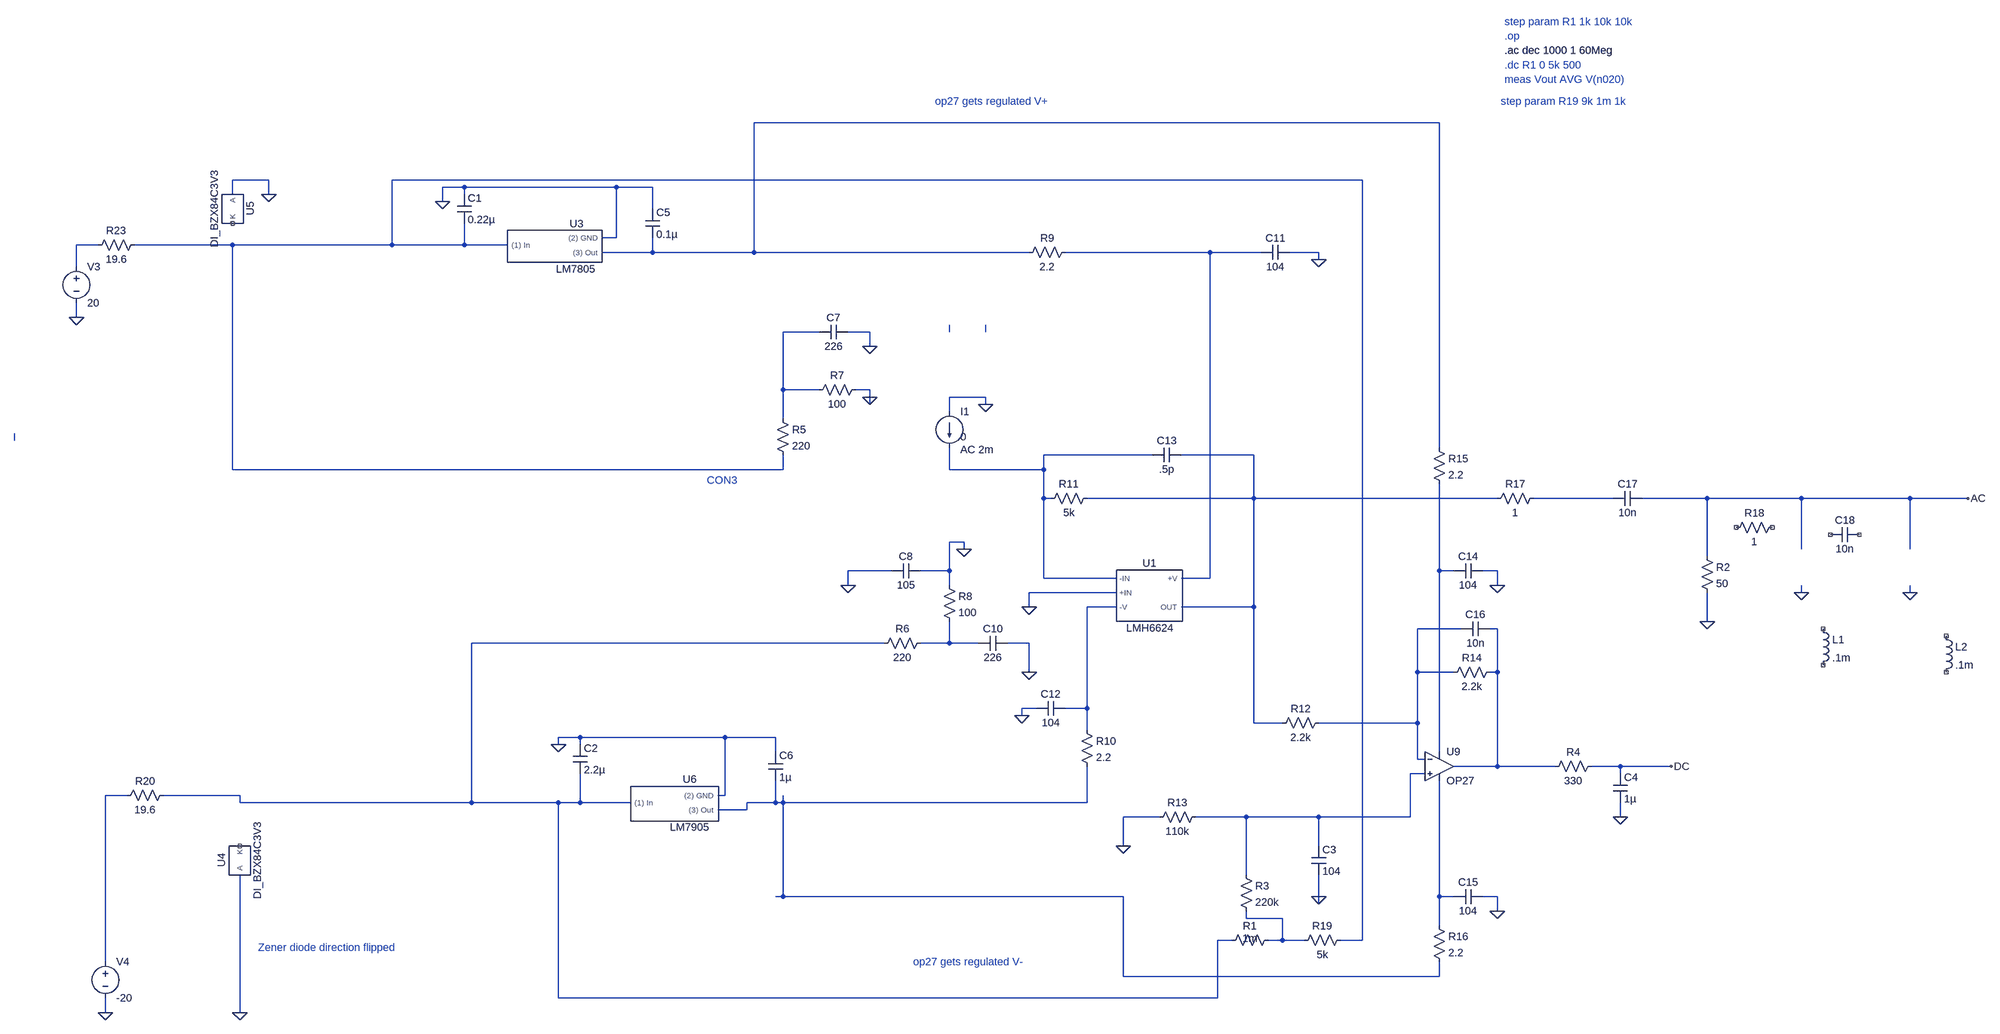
[diagram p0: schematic Photodetector_v2_3.asc]
Photodetector_v2_3.asc, the LTspice schematic file:
Version 4.1
SHEET 1 3536 1256
WIRE 2032 -1264 496 -1264
WIRE -576 -1088 -656 -1088
WIRE 1840 -1088 -304 -1088
WIRE -144 -1072 -192 -1072
WIRE 192 -1072 -144 -1072
WIRE 272 -1072 192 -1072
WIRE -656 -1056 -656 -1088
WIRE -576 -1056 -576 -1088
WIRE -144 -1056 -144 -1072
WIRE -192 -1040 -192 -1072
WIRE 272 -1024 272 -1072
WIRE 192 -960 192 -1072
WIRE 192 -960 160 -960
WIRE -1088 -944 -1136 -944
WIRE -656 -944 -1008 -944
WIRE -304 -944 -304 -1088
WIRE -304 -944 -656 -944
WIRE -144 -944 -144 -992
WIRE -144 -944 -304 -944
WIRE -48 -944 -144 -944
WIRE 272 -928 272 -960
WIRE 272 -928 160 -928
WIRE 496 -928 496 -1264
WIRE 496 -928 272 -928
WIRE 1104 -928 496 -928
WIRE 1504 -928 1184 -928
WIRE 1616 -928 1504 -928
WIRE 1744 -928 1680 -928
WIRE 1744 -912 1744 -928
WIRE -1136 -896 -1136 -944
WIRE -1136 -784 -1136 -816
WIRE 640 -752 560 -752
WIRE 752 -752 704 -752
WIRE 928 -752 928 -768
WIRE 1008 -752 1008 -768
WIRE 752 -720 752 -752
WIRE 560 -624 560 -752
WIRE 640 -624 560 -624
WIRE 752 -624 720 -624
WIRE 752 -608 752 -624
WIRE 1008 -608 928 -608
WIRE 752 -592 752 -608
WIRE 1008 -592 1008 -608
WIRE 928 -576 928 -608
WIRE 560 -560 560 -624
WIRE -1328 -512 -1328 -528
WIRE 2032 -496 2032 -1264
WIRE 1376 -480 1136 -480
WIRE 1600 -480 1440 -480
WIRE -656 -448 -656 -944
WIRE 560 -448 560 -480
WIRE 560 -448 -656 -448
WIRE 928 -448 928 -496
WIRE 1136 -448 1136 -480
WIRE 1136 -448 928 -448
WIRE 1136 -384 1136 -448
WIRE 1152 -384 1136 -384
WIRE 1600 -384 1600 -480
WIRE 1600 -384 1232 -384
WIRE 2160 -384 1600 -384
WIRE 2416 -384 2240 -384
WIRE 2624 -384 2480 -384
WIRE 2832 -384 2624 -384
WIRE 3072 -384 2832 -384
WIRE 3200 -384 3072 -384
WIRE 960 -288 928 -288
WIRE 960 -272 960 -288
WIRE 2832 -272 2832 -384
WIRE 3072 -272 3072 -384
WIRE 2624 -256 2624 -384
WIRE 800 -224 704 -224
WIRE 928 -224 928 -288
WIRE 928 -224 864 -224
WIRE 2032 -224 2032 -416
WIRE 2064 -224 2032 -224
WIRE 2160 -224 2128 -224
WIRE 1136 -208 1136 -384
WIRE 1296 -208 1136 -208
WIRE 1504 -208 1504 -928
WIRE 1504 -208 1440 -208
WIRE 704 -192 704 -224
WIRE 928 -192 928 -224
WIRE 2160 -192 2160 -224
WIRE 1296 -176 1104 -176
WIRE 2832 -176 2832 -192
WIRE 3072 -176 3072 -192
WIRE 1104 -144 1104 -176
WIRE 1296 -144 1232 -144
WIRE 1600 -144 1600 -384
WIRE 1600 -144 1440 -144
WIRE 2624 -112 2624 -176
WIRE 2080 -96 1984 -96
WIRE 2160 -96 2144 -96
WIRE 784 -64 -128 -64
WIRE 928 -64 928 -112
WIRE 928 -64 864 -64
WIRE 992 -64 928 -64
WIRE 1104 -64 1056 -64
WIRE 1104 0 1104 -64
WIRE 1984 0 1984 -96
WIRE 2064 0 1984 0
WIRE 2160 0 2160 -96
WIRE 2160 0 2144 0
WIRE 1120 80 1088 80
WIRE 1232 80 1232 -144
WIRE 1232 80 1184 80
WIRE 1088 96 1088 80
WIRE 1600 112 1600 -144
WIRE 1664 112 1600 112
WIRE 1984 112 1984 0
WIRE 1984 112 1744 112
WIRE 1232 128 1232 80
WIRE 112 144 64 144
WIRE 432 144 112 144
WIRE 544 144 432 144
WIRE 64 160 64 144
WIRE 112 160 112 144
WIRE 544 176 544 144
WIRE 2032 176 2032 -224
WIRE 1984 192 1984 112
WIRE 2000 192 1984 192
WIRE 2160 208 2160 0
WIRE 2160 208 2064 208
WIRE 2288 208 2160 208
WIRE 2432 208 2368 208
WIRE 2544 208 2432 208
WIRE 2000 224 1968 224
WIRE 2432 224 2432 208
WIRE -1024 272 -1072 272
WIRE -640 272 -944 272
WIRE 432 272 432 144
WIRE 432 272 416 272
WIRE -640 288 -640 272
WIRE -128 288 -128 -64
WIRE -128 288 -640 288
WIRE 64 288 -128 288
WIRE 112 288 112 224
WIRE 112 288 64 288
WIRE 224 288 112 288
WIRE 544 288 544 240
WIRE 544 288 480 288
WIRE 560 288 560 272
WIRE 560 288 544 288
WIRE 1232 288 1232 208
WIRE 1232 288 560 288
WIRE 480 304 480 288
WIRE 480 304 416 304
WIRE 1392 320 1312 320
WIRE 1584 320 1472 320
WIRE 1744 320 1584 320
WIRE 1968 320 1968 224
WIRE 1968 320 1744 320
WIRE 2432 320 2432 288
WIRE 1312 384 1312 320
WIRE 1744 384 1744 320
WIRE 1584 448 1584 320
WIRE 560 496 560 288
WIRE 560 496 544 496
WIRE 1312 496 560 496
WIRE 1744 496 1744 448
WIRE 2032 496 2032 240
WIRE 2064 496 2032 496
WIRE 2160 496 2128 496
WIRE 1744 512 1744 496
WIRE 2160 528 2160 496
WIRE 1584 544 1584 528
WIRE 1664 544 1584 544
WIRE 2032 560 2032 496
WIRE 1552 592 1520 592
WIRE 1664 592 1664 544
WIRE 1664 592 1632 592
WIRE 1712 592 1664 592
WIRE 1840 592 1840 -1088
WIRE 1840 592 1792 592
WIRE -1072 640 -1072 272
WIRE 1312 672 1312 496
WIRE 2032 672 2032 640
WIRE 2032 672 1312 672
WIRE 64 720 64 288
WIRE 1520 720 1520 592
WIRE 1520 720 64 720
WIRE -1072 752 -1072 720
WIRE -640 752 -640 448
FLAG 1104 0 0
FLAG 704 -192 0
FLAG 1104 -144 0
FLAG 2160 528 0
FLAG 2160 -192 0
FLAG 2624 -112 0
FLAG 752 -720 0
FLAG 1744 496 0
FLAG 1312 384 0
FLAG 64 160 0
FLAG 1088 96 0
FLAG 1744 -912 0
FLAG 3200 -384 AC
FLAG 2544 208 DC
FLAG -640 752 0
FLAG -576 -1056 0
FLAG -1136 -784 0
FLAG -1072 752 0
FLAG 2432 320 0
FLAG -192 -1040 0
FLAG 3072 -176 0
FLAG 2832 -176 0
FLAG 1008 -592 0
FLAG 752 -608 0
FLAG 960 -272 0
DATAFLAG 1136 -176 ""
DATAFLAG 1120 80 ""
DATAFLAG 2336 -384 ""
DATAFLAG 2112 -384 ""
DATAFLAG 208 -928 ""
DATAFLAG -592 -944 ""
DATAFLAG -480 288 ""
DATAFLAG 576 288 ""
DATAFLAG 1520 -144 ""
DATAFLAG 1504 -336 ""
DATAFLAG 1232 -96 ""
DATAFLAG 2160 208 ""
DATAFLAG 2160 -64 ""
DATAFLAG 1920 112 ""
DATAFLAG 2160 208 ""
DATAFLAG 2160 208 ""
DATAFLAG 2032 304 ""
DATAFLAG 2032 -160 ""
DATAFLAG 3200 -400 ""
DATAFLAG 3152 -384 ""
DATAFLAG 2528 208 ""
SYMBOL res 544 -576 R0
SYMATTR InstName R5
SYMATTR Value 220
SYMBOL res 880 -80 R90
WINDOW 0 0 56 VBottom 2
WINDOW 3 32 56 VTop 2
SYMATTR InstName R6
SYMATTR Value 220
SYMBOL res 736 -640 R90
WINDOW 0 0 56 VBottom 2
WINDOW 3 32 56 VTop 2
SYMATTR InstName R7
SYMATTR Value 100
SYMBOL res 912 -208 R0
SYMATTR InstName R8
SYMATTR Value 100
SYMBOL res 1200 -944 R90
WINDOW 0 0 56 VBottom 2
WINDOW 3 32 56 VTop 2
SYMATTR InstName R9
SYMATTR Value 2.2
SYMBOL res 1216 112 R0
SYMATTR InstName R10
SYMATTR Value 2.2
SYMBOL res 1248 -400 R90
WINDOW 0 0 56 VBottom 2
WINDOW 3 32 56 VTop 2
SYMATTR InstName R11
SYMATTR Value 5k
SYMBOL res 1760 96 R90
WINDOW 0 0 56 VBottom 2
WINDOW 3 32 56 VTop 2
SYMATTR InstName R12
SYMATTR Value 2.2k
SYMBOL res 1488 304 R90
WINDOW 0 0 56 VBottom 2
WINDOW 3 32 56 VTop 2
SYMATTR InstName R13
SYMATTR Value 110k
SYMBOL res 2160 -16 R90
WINDOW 0 0 56 VBottom 2
WINDOW 3 32 56 VTop 2
SYMATTR InstName R14
SYMATTR Value 2.2k
SYMBOL res 2016 -512 R0
SYMATTR InstName R15
SYMATTR Value 2.2
SYMBOL res 2016 544 R0
SYMATTR InstName R16
SYMATTR Value 2.2
SYMBOL res 2256 -400 R90
WINDOW 0 0 56 VBottom 2
WINDOW 3 32 56 VTop 2
SYMATTR InstName R17
SYMATTR Value 1
SYMBOL res 2384 192 R90
WINDOW 0 0 56 VBottom 2
WINDOW 3 32 56 VTop 2
SYMATTR InstName R4
SYMATTR Value 330
SYMBOL res 2608 -272 R0
SYMATTR InstName R2
SYMATTR Value 50
SYMBOL res 1568 432 R0
SYMATTR InstName R3
SYMATTR Value 220k
SYMBOL cap -160 -1056 R0
SYMATTR InstName C1
SYMATTR Value 0.22µ
SYMBOL cap 96 160 R0
SYMATTR InstName C2
SYMATTR Value 2.2µ
SYMBOL cap 2416 224 R0
SYMATTR InstName C4
SYMATTR Value 1µ
SYMBOL cap 256 -1024 R0
SYMATTR InstName C5
SYMATTR Value 0.1µ
SYMBOL cap 528 176 R0
SYMATTR InstName C6
SYMATTR Value 1µ
SYMBOL cap 704 -768 R90
WINDOW 0 0 32 VBottom 2
WINDOW 3 32 32 VTop 2
SYMATTR InstName C7
SYMATTR Value 226
SYMBOL cap 864 -240 R90
WINDOW 0 0 32 VBottom 2
WINDOW 3 32 32 VTop 2
SYMATTR InstName C8
SYMATTR Value 105
SYMBOL cap 1056 -80 R90
WINDOW 0 0 32 VBottom 2
WINDOW 3 32 32 VTop 2
SYMATTR InstName C10
SYMATTR Value 226
SYMBOL cap 1680 -944 R90
WINDOW 0 0 32 VBottom 2
WINDOW 3 32 32 VTop 2
SYMATTR InstName C11
SYMATTR Value 104
SYMBOL cap 1184 64 R90
WINDOW 0 0 32 VBottom 2
WINDOW 3 32 32 VTop 2
SYMATTR InstName C12
SYMATTR Value 104
SYMBOL cap 1440 -496 R90
WINDOW 0 0 32 VBottom 2
WINDOW 3 32 32 VTop 2
SYMATTR InstName C13
SYMATTR Value .5p
SYMBOL cap 2128 -240 R90
WINDOW 0 0 32 VBottom 2
WINDOW 3 32 32 VTop 2
SYMATTR InstName C14
SYMATTR Value 104
SYMBOL cap 2128 480 R90
WINDOW 0 0 32 VBottom 2
WINDOW 3 32 32 VTop 2
SYMATTR InstName C15
SYMATTR Value 104
SYMBOL cap 2144 -112 R90
WINDOW 0 0 32 VBottom 2
WINDOW 3 32 32 VTop 2
SYMATTR InstName C16
SYMATTR Value 10n
SYMBOL cap 2480 -400 R90
WINDOW 0 0 32 VBottom 2
WINDOW 3 32 32 VTop 2
SYMATTR InstName C17
SYMATTR Value 10n
SYMBOL cap 1728 384 R0
SYMATTR InstName C3
SYMATTR Value 104
SYMBOL LMH6624 1408 -176 R0
SYMATTR InstName U1
SYMBOL DI_BZX84C3V3 -640 416 R270
SYMATTR InstName U4
SYMBOL DI_BZX84C3V3 -656 -1024 R90
SYMATTR InstName U5
SYMBOL current 928 -576 R0
WINDOW 123 24 84 Left 2
WINDOW 39 0 0 Left 0
WINDOW 3 24 56 Left 2
SYMATTR Value2 AC 2m
SYMATTR Value 0
SYMATTR InstName I1
SYMBOL OpAmps\\OP27 2032 144 R0
SYMATTR InstName U9
SYMBOL LM7805 112 -944 R0
WINDOW 0 -8 -31 Bottom 2
WINDOW 3 -9 37 Top 2
SYMATTR InstName U3
SYMBOL LM7905 416 288 R0
WINDOW 0 -62 -36 Bottom 2
WINDOW 3 -62 39 Top 2
SYMATTR InstName U6
SYMBOL voltage -1136 -912 R0
WINDOW 123 24 44 Left 2
WINDOW 39 0 0 Left 0
SYMATTR InstName V3
SYMATTR Value 20
SYMBOL voltage -1072 624 R0
WINDOW 123 24 124 Left 2
WINDOW 39 0 0 Left 0
SYMATTR InstName V4
SYMATTR Value -20
SYMBOL res 1648 576 R90
WINDOW 0 0 56 VBottom 2
WINDOW 3 28 56 VBottom 2
SYMATTR InstName R1
SYMATTR Value 1m
SYMBOL cap 2960 -320 R90
WINDOW 0 0 32 VBottom 2
WINDOW 3 32 32 VTop 2
SYMATTR InstName C18
SYMATTR Value 10n
SYMBOL ind 3136 -96 R0
SYMATTR InstName L2
SYMATTR Value .1m
SYMBOL ind 2864 -112 R0
SYMATTR InstName L1
SYMATTR Value .1m
SYMBOL res 2784 -336 R90
WINDOW 0 0 56 VBottom 2
WINDOW 3 32 56 VTop 2
SYMATTR InstName R18
SYMATTR Value 1
SYMBOL res 1808 576 R90
WINDOW 0 0 56 VBottom 2
WINDOW 3 32 56 VTop 2
SYMATTR InstName R19
SYMATTR Value 5k
SYMBOL res -928 256 R90
WINDOW 0 0 56 VBottom 2
WINDOW 3 32 56 VTop 2
SYMATTR InstName R20
SYMATTR Value 19.6
SYMBOL res -992 -960 R90
WINDOW 0 0 56 VBottom 2
WINDOW 3 32 56 VTop 2
SYMATTR InstName R23
SYMATTR Value 19.6
TEXT 392 -424 Left 2 ;CON3
TEXT 2176 -1392 Left 2 ;.dc R1 0 5k 500
TEXT 2176 -1424 Left 2 !.ac dec 1000 1 60Meg
TEXT 848 640 Left 2 ;op27 gets regulated V-
TEXT -600 608 Left 2 ;Zener diode direction flipped
TEXT 896 -1312 Left 2 ;op27 gets regulated V+
TEXT 2176 -1488 Left 2 ;step param R1 1k 10k 10k
TEXT 2176 -1456 Left 2 ;.op
TEXT 2176 -1360 Left 2 ;meas Vout AVG V(n020)
TEXT 2168 -1312 Left 2 ;step param R19 9k 1m 1k

The netlist it stands for:
* Photodetector_v2_3.asc
R5 N005 N002 220
R6 N017 N016 220
R7 0 N005 100
R8 0 N017 100
R9 N004 N001 2.2
R10 N013 N020 2.2
R11 N010 N009 5k
R12 N014 N010 2.2k
R13 N018 0 110k
R14 N015 N014 2.2k
R15 N001 N012 2.2
R16 N021 N020 2.2
R17 N011 N010 1
R4 DC N015 330
R2 AC 0 50
R3 N018 N022 220k
C1 0 N002 0.22µ
C2 0 N016 2.2µ
C4 DC 0 1µ
C5 0 N001 0.1µ
C6 0 N020 1µ
C7 0 N005 226
C8 0 0 105
C10 0 N017 226
C11 0 N004 104
C12 N013 0 104
C13 N010 N009 .5p
C14 0 N012 104
C15 0 N021 104
C16 N015 N014 10n
C17 AC N011 10n
C3 N018 0 104
X§U1 0 N009 N004 N013 N010 LMH6624  ; pins +IN -IN +V -V OUT
X§U4 0 NC_01 DI_BZX84C3V3  ; pins A K
X§U5 0 NC_02 DI_BZX84C3V3  ; pins A K
I1 0 N009 0 AC 2m
X§U9 N018 N014 N012 N021 N015 OP27  ; pins In+ In- V+ V- OUT
X§U3 N002 0 N001 LM7805  ; pins (1)_In (2)_GND (3)_Out
X§U6 N016 0 N020 LM7905  ; pins (1)_In (2)_GND (3)_Out
V3 N003 0 20
V4 N019 0 -20
R1 N022 N016 1m
C18 NC_03 NC_04 10n
L2 NC_05 NC_06 .1m
L1 NC_07 NC_08 .1m
R18 NC_09 NC_10 1
R19 N002 N022 5k
R20 N016 N019 19.6
R23 N002 N003 19.6
* CON3
* .dc R1 0 5k 500
.ac dec 1000 1 60Meg
* op27 gets regulated V-
* Zener diode direction flipped
* op27 gets regulated V+
* step param R1 1k 10k 10k
* .op
* meas Vout AVG V(n020)
* step param R19 9k 1m 1k
.lib C:\Users\ruhiy\projects\photodetector\snom130\LMH6624\LMH6624.MOD
.lib C:\Users\ruhiy\Downloads\BZX84C3V3.spice.txt
.lib ADI.lib
.lib C:\Users\ruhiy\projects\photodetector\regulators.lib.txt
.backanno
.end